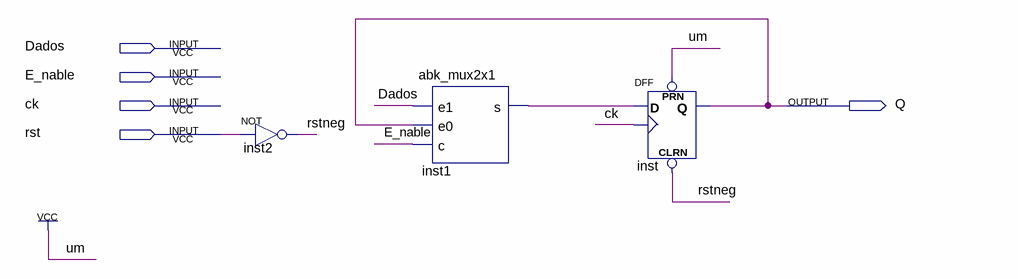
[diagram p0: schematic sheet]
// Quartus schematic abk_flip_flop_customizado.bdf as structural Verilog: 3 symbols, 5 pins
module abk_flip_flop_customizado (
  input  Dados,
  input  E_nable,
  input  ck,
  input  rst,
  output Q
);

  wire inst1_s, rstneg;

  not inst2 (rstneg, rst);
  abk_mux2x1 inst1 (.e1(Dados), .e0(Q), .c(E_nable), .s(inst1_s));
  DFF inst (.CLRN(rstneg), .CLK(ck), .D(inst1_s), .PRN(1'b1), .Q(Q));
endmodule
